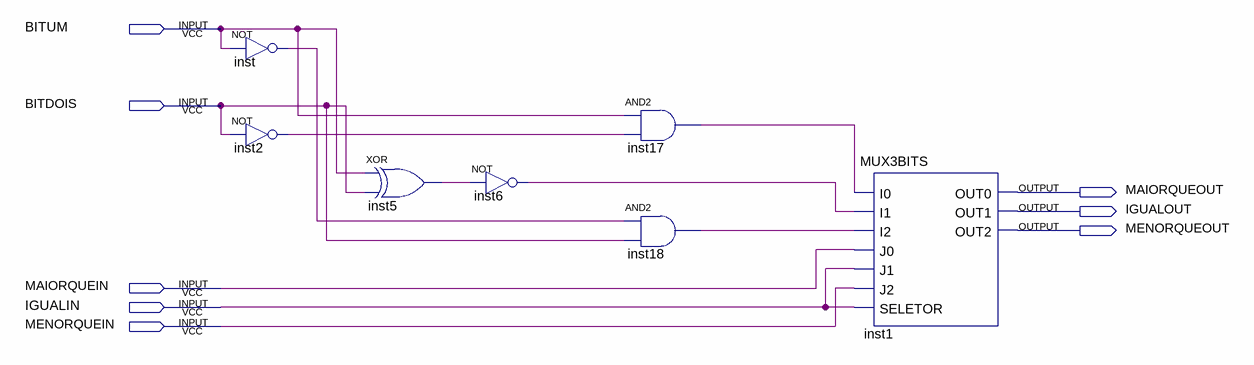
[diagram p0: schematic sheet]
// Quartus schematic UNIDADECOMPARATIVA.bdf as structural Verilog: 7 symbols, 8 pins
module UNIDADECOMPARATIVA (
  input  BITUM,
  input  BITDOIS,
  input  MAIORQUEIN,
  input  IGUALIN,
  input  MENORQUEIN,
  output MAIORQUEOUT,
  output IGUALOUT,
  output MENORQUEOUT
);

  wire inst2_out, inst5_out, inst6_out, inst17_out, inst18_out, inst_out;

  not inst (inst_out, BITUM);
  not inst2 (inst2_out, BITDOIS);
  xor inst5 (inst5_out, BITUM, BITDOIS);
  not inst6 (inst6_out, inst5_out);
  and inst17 (inst17_out, BITUM, inst2_out);
  and inst18 (inst18_out, inst_out, BITDOIS);
  MUX3BITS inst1 (
    .I0(inst17_out), .I1(inst6_out), .I2(inst18_out), .J0(MAIORQUEIN), .J1(IGUALIN), .J2(MENORQUEIN),
    .SELETOR(IGUALIN), .OUT0(MAIORQUEOUT), .OUT1(IGUALOUT), .OUT2(MENORQUEOUT));
endmodule
